# EAGLE design tst (EAGLE 7.7.0)
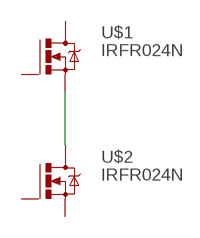
[diagram p0: schematic, sheet 1]

## Parts
U$1  IRFR024N  [D-PAK_TO252AA]
U$2  IRFR024N  [D-PAK_TO252AA]

## Nets
N$1: U$1.3(S) U$2.2(D)
Unconnected: U$1.1(G) U$1.2(D) U$2.1(G) U$2.3(S)

## Library data of the parts
U$1 U$2 = CasaLibrary:IRFR024N

## Board
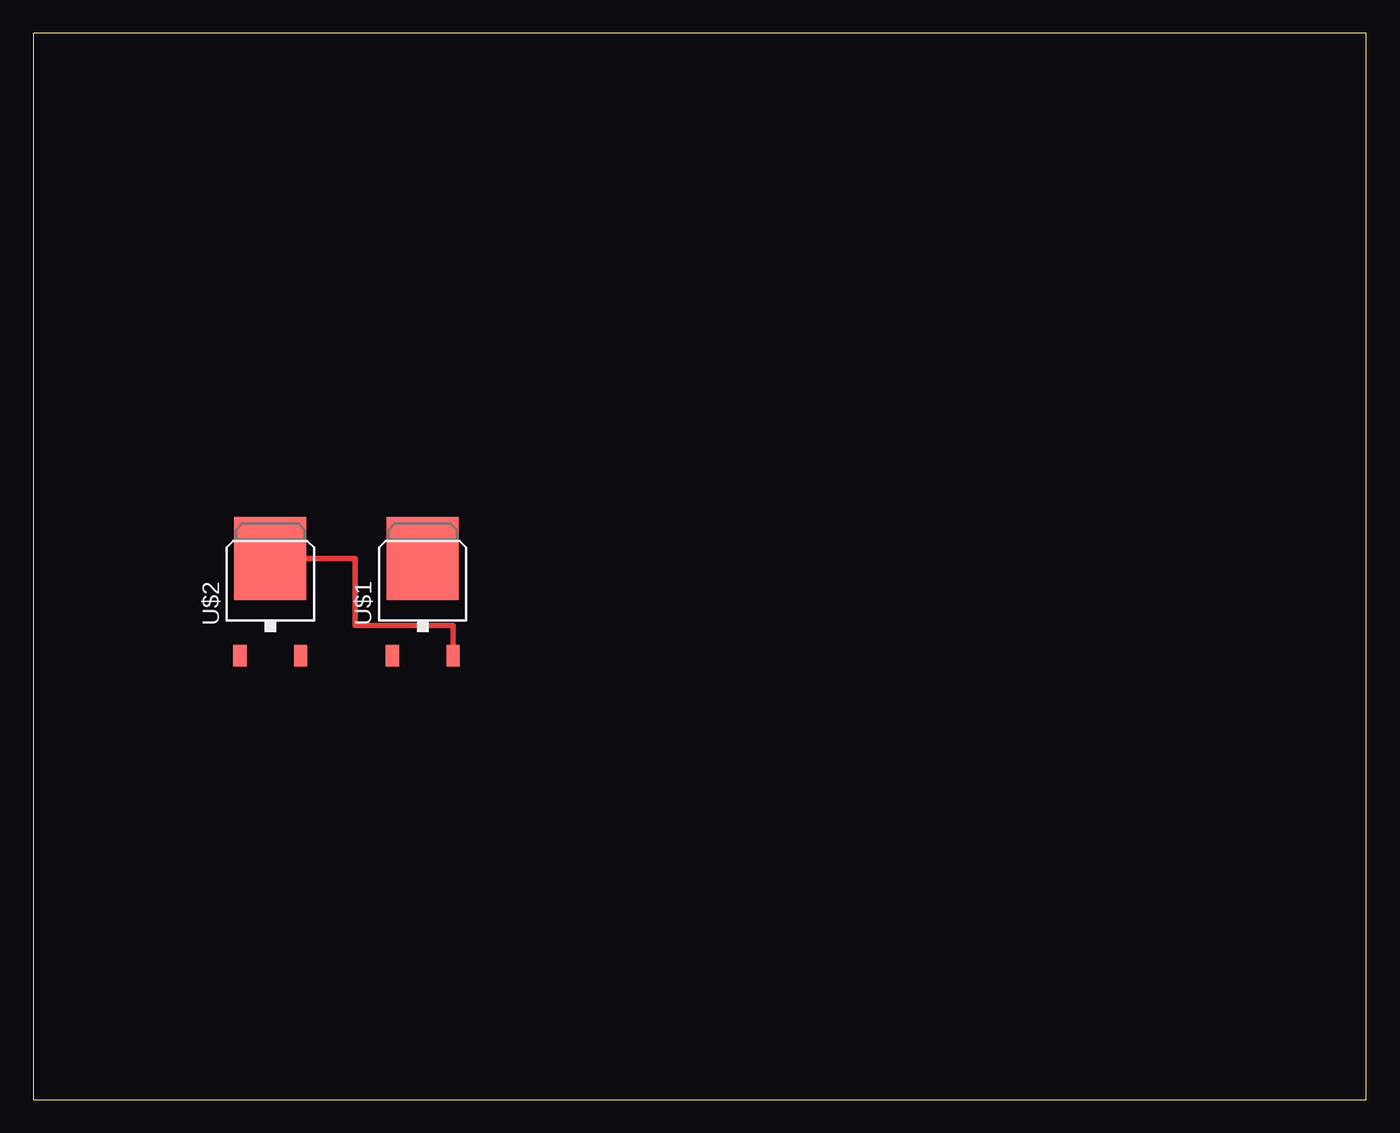
[diagram p1: board, top side]

Size 100 x 80 mm. Coordinates in mm from the lower left corner, seen from the top.
Outline: 0,0 100,0 100,80 0,80 0,0
Copper layers (1*16): Top 0.035mm / dielectric 1.5mm / Bottom 0.035mm
Design rules "default": minimum track width 10mil, minimum drill 0.6mm, track to track 8mil, track to pad 8mil, pad to pad 8mil, via to via 8mil, smd to smd 8mil, copper to edge 40mil, drill to drill 8mil, minimum pad ring 10mil, minimum via ring 8mil, stop-mask expansion 4mil, vias tented up to drill 0mil, thermal gap 10mil

### Footprints (pad centres in the part's own frame; a part is rotated, then mirrored left to right if it is on the bottom)
D-PAK_TO252AA = smd 1 x 1.6: 1 -2.28,-4.8; 3 2.28,-4.8 | smd 5.4 x 6.2: 2 0,2.5

### Placement (x,y rotation side)
U$1  29.21,38.1 0 top
U$2  17.78,38.1 0 top

### Tracks (layer width: path | path; a pad name or v marks a point on that pad's centre or on a via)
N$1
  Top 0.406: U$1.3 31.49,35.56 24.13,35.56 24.13,40.6 U$2.2